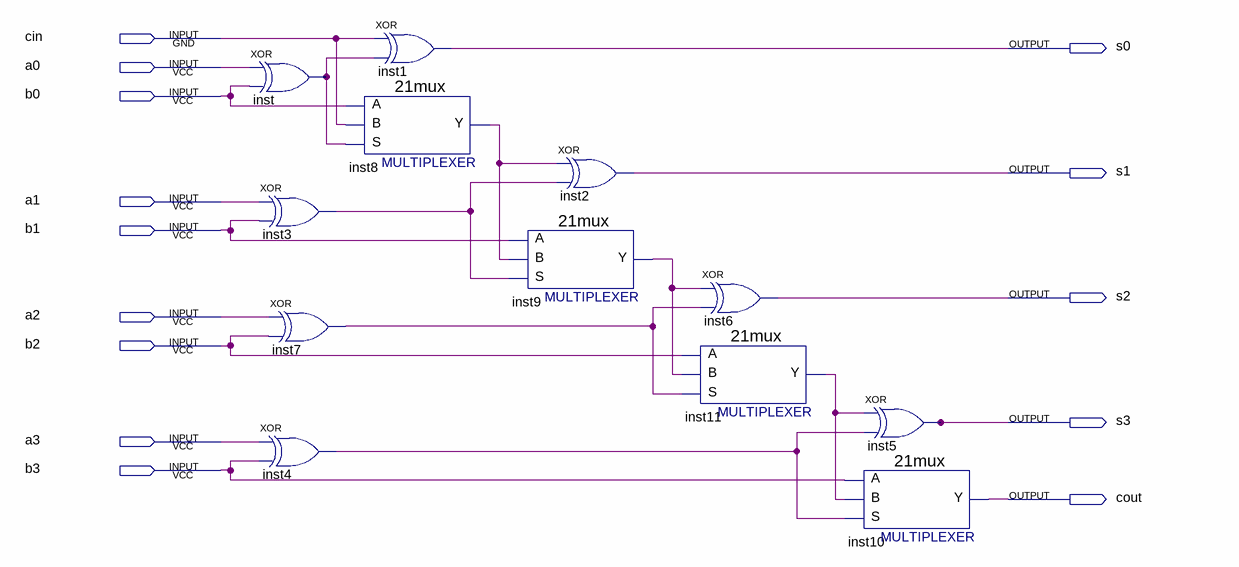
[diagram p0: schematic sheet]
// Quartus schematic fourBitAdder.bdf as structural Verilog: 12 symbols, 14 pins
module fourBitAdder (
  input  cin,
  input  a0,
  input  b0,
  input  a1,
  input  b1,
  input  a2,
  input  b2,
  input  a3,
  input  b3,
  output s0,
  output s1,
  output s2,
  output s3,
  output cout
);

  wire inst3_out, inst4_out, inst7_out, inst8_y, inst9_y, inst11_y, inst_out;

  xor inst (inst_out, a0, b0);
  xor inst3 (inst3_out, a1, b1);
  xor inst4 (inst4_out, a3, b3);
  xor inst7 (inst7_out, a2, b2);
  xor inst1 (s0, cin, inst_out);
  \21mux  inst8 (.S(inst_out), .B(cin), .A(b0), .Y(inst8_y));
  xor inst2 (s1, inst8_y, inst3_out);
  \21mux  inst9 (.S(inst3_out), .B(inst8_y), .A(b1), .Y(inst9_y));
  xor inst6 (s2, inst9_y, inst7_out);
  \21mux  inst11 (.S(inst7_out), .B(inst9_y), .A(b2), .Y(inst11_y));
  xor inst5 (s3, inst11_y, inst4_out);
  \21mux  inst10 (.S(inst4_out), .B(inst11_y), .A(b3), .Y(cout));
endmodule
